# EAGLE design Xbee_Remote_v1.0 (EAGLE 6.2)
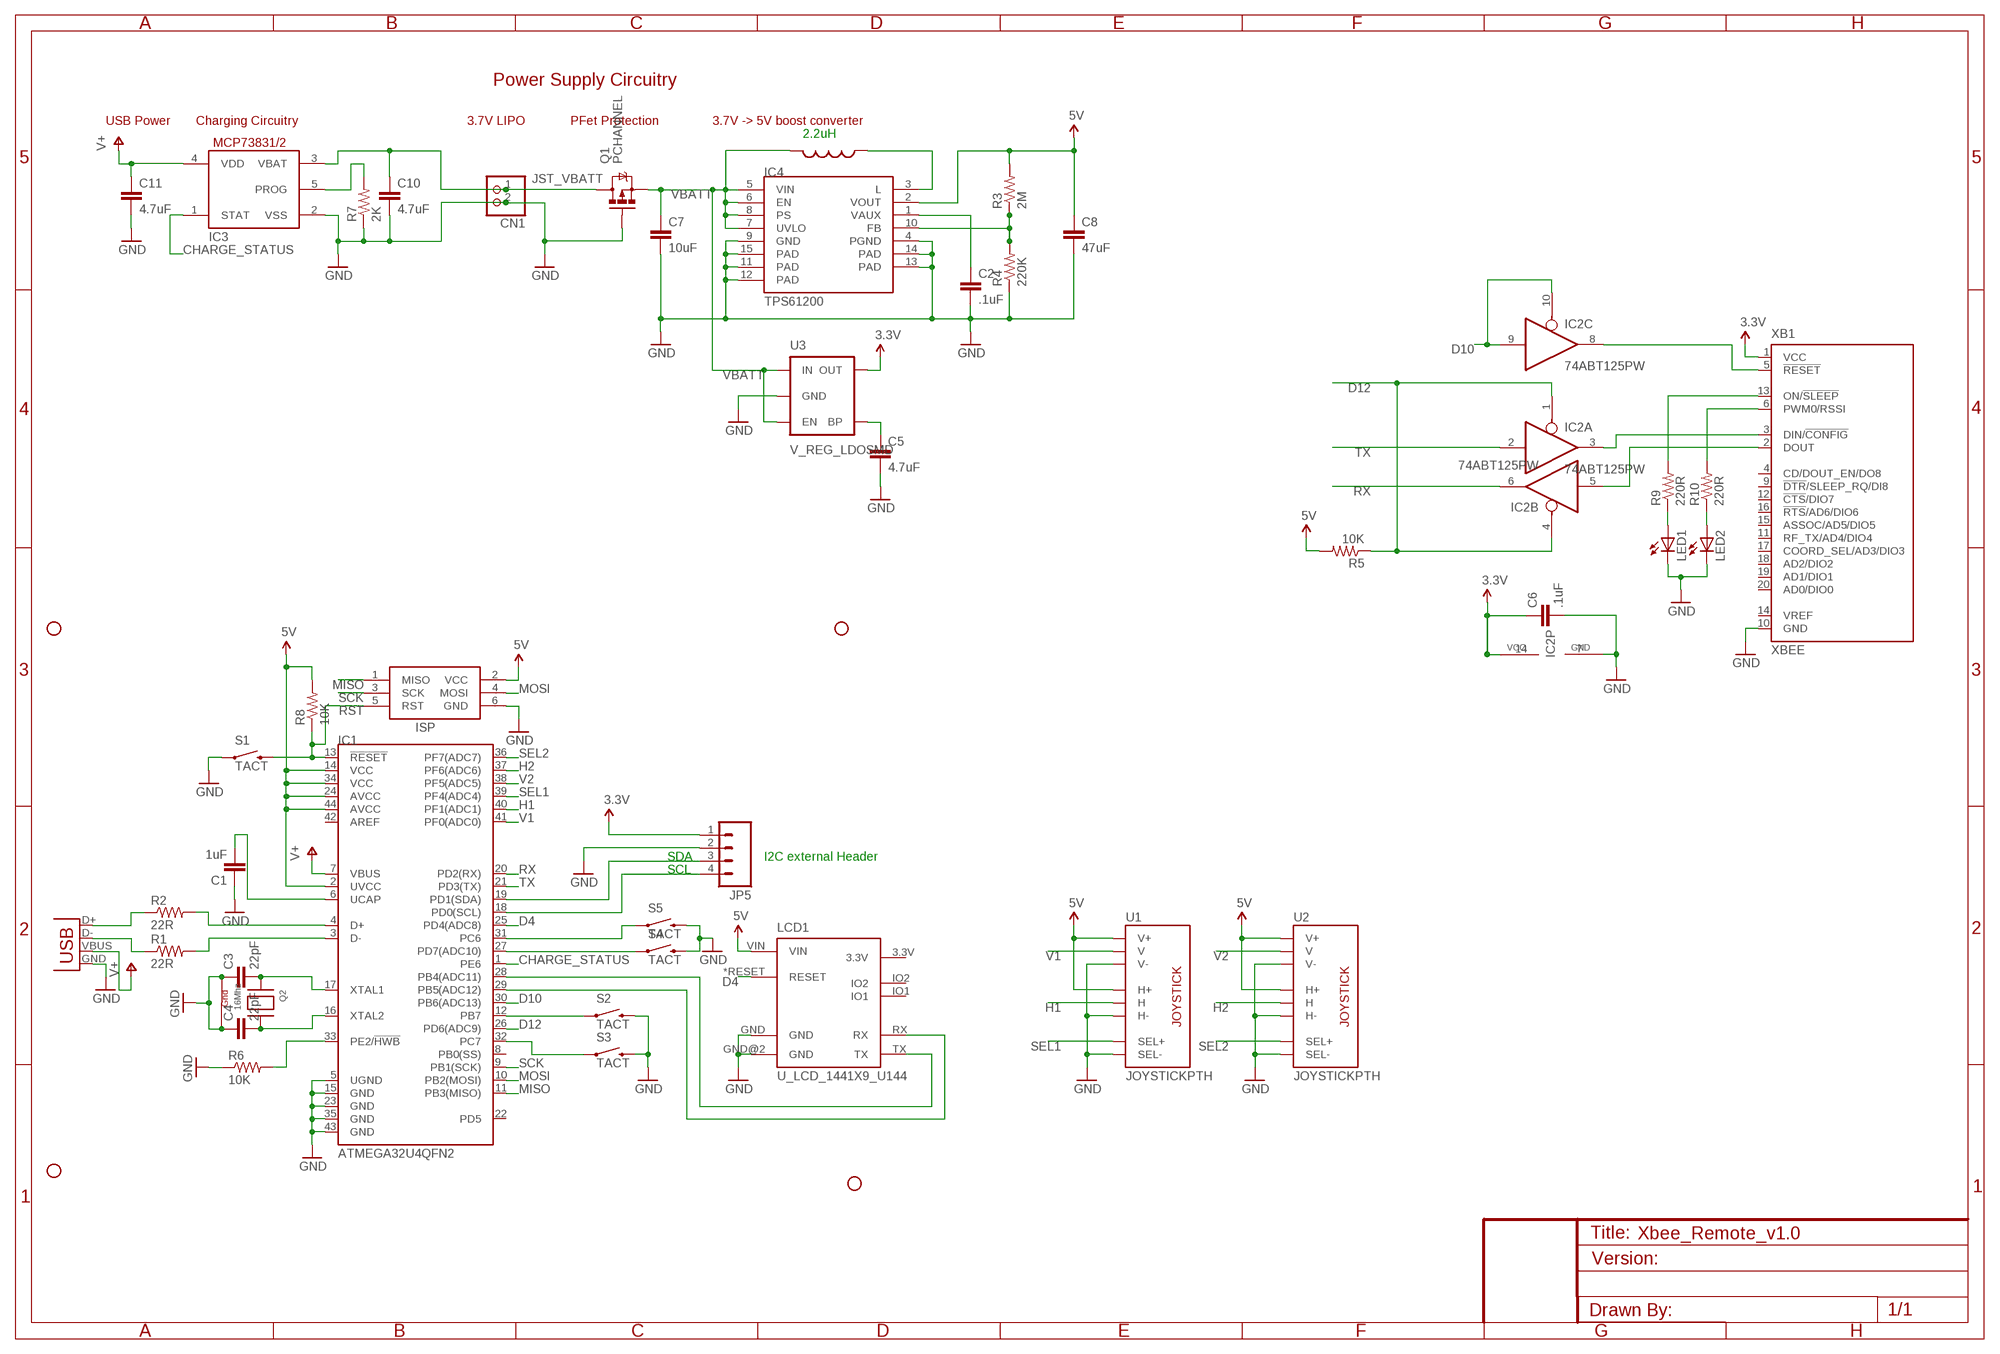
[diagram p0: schematic, sheet 1]

## Parts
C1  1uF  CAP0805  [0805]
C2  .1uF  CAP0805  [0805]
C3  22pF  CAP0805  [0805]
C4  22pF  CAP0805  [0805]
C5  4.7uF  CAP0805  [0805]
C6  .1uF  CAP0805  [0805]
C7  10uF  CAP0805  [0805]
C8  47uF  CAP1206  [1206]
C10  4.7uF  CAP0805  [0805]
C11  4.7uF  CAP0805  [0805]
CN1  JST_2PIN-SMT-RA  [JST-PH-2-SMT-RA]
IC1  ATMEGA32U4QFN2  [QFN-44-NOPAD]
IC2  74ABT125PW  [TSSOP14]
IC3  MCP73831/OT  [SOT23-5L]
IC4  TPS61200  [QFN-10_PAD]
ISP  AVRISP-6  [AVRISP]
JP1  STAND-OFF  [STAND-OFF]
JP2  STAND-OFF  [STAND-OFF]
JP3  STAND-OFF  [STAND-OFF]
JP4  STAND-OFF  [STAND-OFF]
JP5  M04PTH  [1X04]
L1  2.2uH  INDUCTOREPL2014  [COILCRAFT_EPL2014]
LCD1  U_LCD_1441X9_U144  [U_LCD_144]
LED1  LEDCHIPLED_0805  [CHIPLED_0805]
LED2  LEDCHIPLED_0805  [CHIPLED_0805]
Q1  PCHANNEL  MOSFET-PCHANNELSMD  [SOT23-3]
Q2  16Mhz  XTAL-4-3225  [NX3225]
R1  22R  RESISTOR  [0805]
R2  22R  RESISTOR  [0805]
R3  2M  RESISTOR  [0805]
R4  220K  RESISTOR  [0805]
R5  10K  RESISTOR  [0805]
R6  10K  RESISTOR  [0805]
R7  2K  RESISTOR  [0805]
R8  10K  RESISTOR  [0805]
R9  220R  RESISTOR  [0805]
R10  220R  RESISTOR  [0805]
S1  TACT  SWITCH-MOMENTARY-2SMD  [TACTILE_SWITCH_SMD]
S2  TACT  SWITCH-MOMENTARY-2SMD  [TACTILE_SWITCH_SMD]
S3  TACT  SWITCH-MOMENTARY-2SMD  [TACTILE_SWITCH_SMD]
S4  TACT  SWITCH-MOMENTARY-2SMD  [TACTILE_SWITCH_SMD]
S5  TACT  SWITCH-MOMENTARY-2SMD  [TACTILE_SWITCH_SMD]
U1  JOYSTICKPTH  [JOYSTICK]
U2  JOYSTICKPTH  [JOYSTICK]
U3  V_REG_LDOSMD  [SOT23-5]
X1  USB-MICROB  [USB-MICROB]
XB1  XBEE  [XBEE]

## Nets
3.3V: C6.1 IC2.14(P:VCC) JP5.1 U3.5(OUT) XB1.1(VCC)
5V: C8.1 IC1.2(UVCC) IC1.14(VCC) IC1.24(AVCC) IC1.34(VCC) IC1.44(AVCC) IC4.2(VOUT) ISP.2(VCC) LCD1.VIN R3.2 R5.2 R8.2 U1.H1(H+) U1.V1(V+) U2.H1(H+) U2.V1(V+)
CHARGE_STATUS: IC1.1(PE6) IC3.1(STAT)
D2: IC1.19(PD1(SDA)) JP5.3
D3: IC1.18(PD0(SCL)) JP5.4
D4: IC1.25(PD4(ADC8)) LCD1.*RESET(RESET)
D5: IC1.31(PC6) S5.1
D6: IC1.27(PD7(ADC10)) S4.1
D10: IC1.30(PB6(ADC13)) IC2.9(C:I) IC2.10(C:OE)
D11: IC1.12(PB7) S2.1
D12: IC1.26(PD6(ADC9)) IC2.1(A:OE) IC2.4(B:OE) R5.1
D13: IC1.32(PC7) S3.1
GND: C1.1 C2.2 C3.1 C4.1 C5.2 C6.2 C7.2 C8.2 C10.2 C11.2 CN1.2 IC1.5(UGND) IC1.15(GND) IC1.23(GND) IC1.35(GND) IC1.43(GND) IC2.7(P:GND) IC3.2(VSS) IC4.4(PGND) IC4.9(GND) IC4.11(PAD) IC4.12(PAD) IC4.13(PAD) IC4.14(PAD) IC4.15(PAD) ISP.6(GND) JP5.2 LCD1.GND LCD1.GND@2(GND) LED1.C LED2.C Q1.1(G) Q2.2(G1) Q2.4(G2) R4.1 R6.1 R7.1 S1.1 S2.3 S3.3 S4.3 S5.3 U1.B2A(SEL-) U1.H3(H-) U1.V3(V-) U2.B2A(SEL-) U2.H3(H-) U2.V3(V-) U3.2(GND) X1.GND XB1.10(GND)
H1: IC1.40(PF1(ADC1)) U1.H2(H)
H2: IC1.37(PF6(ADC6)) U2.H2(H)
JST_VBATT: C10.1 CN1.1 IC3.3(VBAT) Q1.3(D)
LCD_RX: IC1.29(PB5(ADC12)) LCD1.RX
LCD_TX: IC1.28(PB4(ADC11)) LCD1.TX
MISO: IC1.11(PB3(MISO)) ISP.1(MISO)
MOSI: IC1.10(PB2(MOSI)) ISP.4(MOSI)
N$1: R2.1 X1.D+
N$2: R1.1 X1.D-
N$3: IC1.4(D+) R2.2
N$4: IC1.3(D-) R1.2
N$5: C1.2 IC1.6(UCAP)
N$6: IC3.5(PROG) R7.2
N$7: IC4.3(L) L1.P$1
N$8: C5.1 U3.4(BP)
N$9: IC4.10(FB) R3.1 R4.2
N$10: C2.1 IC4.1(VAUX)
N$11: C3.2 IC1.17(XTAL1) Q2.1(X1)
N$13: C4.2 IC1.16(XTAL2) Q2.3(X2)
N$14: IC2.8(C:O) XB1.5(!RESET)
N$16: IC1.33(PE2/!HWB) R6.2
N$18: LED1.A R9.1
N$19: LED2.A R10.1
ON: R9.2 XB1.13(ON/!SLEEP)
RSSI: R10.2 XB1.6(PWM0/RSSI)
RST: IC1.13(!RESET) ISP.5(RST) R8.1 S1.3
RX: IC1.20(PD2(RX)) IC2.6(B:O)
SCK: IC1.9(PB1(SCK)) ISP.3(SCK)
SEL1: IC1.39(PF4(ADC4)) U1.B1A(SEL+)
SEL2: IC1.36(PF7(ADC7)) U2.B1A(SEL+)
TX: IC1.21(PD3(TX)) IC2.2(A:I)
V1: IC1.41(PF0(ADC0)) U1.V2(V)
V2: IC1.38(PF5(ADC5)) U2.V2(V)
V+: C11.1 IC1.7(VBUS) IC3.4(VDD) X1.VBUS
VBATT: C7.1 IC4.5(VIN) IC4.6(EN) IC4.7(UVLO) IC4.8(PS) L1.P$2 Q1.2(S) U3.1(IN) U3.3(EN)
XBEE_RX: IC2.3(A:O) XB1.3(DIN/!CONFIG)
XBEE_TX: IC2.5(B:I) XB1.2(DOUT)
Unconnected: IC1.8(PB0(SS)) IC1.22(PD5) IC1.42(AREF) IC2.11(D:O) IC2.12(D:I) IC2.13(D:OE) LCD1.3.3V LCD1.IO1 LCD1.IO2 XB1.4(CD/DOUT_EN/DO8) XB1.9(!DTR!/SLEEP_RQ/DI8) XB1.11(RF_TX/AD4/DIO4) XB1.12(!CTS!/DIO7) XB1.14(VREF) XB1.15(ASSOC/AD5/DIO5) XB1.16(!RTS!/AD6/DIO6) XB1.17(COORD_SEL/AD3/DIO3) XB1.18(AD2/DIO2) XB1.19(AD1/DIO1) XB1.20(AD0/DIO0)

## Notes on the sheet
- Power Supply Circuitry
- USB Power | Charging Circuitry | 3.7V LIPO | PFet Protection | 3.7V -> 5V boost converter
- 2.2uH
- SDA | I2C external Header
- SCL

## Library data of the parts
C1-C7 C10 C11 = KippKitts:CAP: Capacitor Standard 0603 ceramic capacitor, and 0.1" leaded capacitor.
C8 = SparkFun:CAP: Capacitor Standard 0603 ceramic capacitor, and 0.1" leaded capacitor.
CN1 = adafruit:JST_2PIN: JST 2-Pin Connectors of various flavors SMT-RA (S2B-PH-SM4) 4UConnector #17311 SMT (B2B-PH-SM4) THM-RA (S2B-PH) THM (B2B-PH)
IC1 = SparkFun:ATMEGA32U4
IC2 = 74xx-us:74*125: Quad bus BUFFER, 3-state
IC3 = adafruit:MCP73831: MCP73831/2 Miniature Single-Cell, Fully Integrated Li-Ion, Li-Polymer Charge Management Controllers. Nice and small simple lipoly charge controller, with adjustable current and status output (LED) http://www.ladyada.net/library/pcb/eaglelibrary.html
IC4 = SparkFun:TPS61200: DC to DC Booster
ISP = adafruit:AVRISP: AVR ISP HEADER Standard 6 pin header for AVR programming
JP1-JP4 = SparkFun:STAND-OFF: Stand Off This is the mechanical footprint for a #4 phillips button head screw. Use the keepout ring to avoid running the screw head into surrounding components. SKU : PRT-00447
JP5 = SparkFun:M04: Header 4 Standard 4-pin 0.1" header. Use with straight break away headers (SKU : PRT-00116), right angle break away headers (PRT-00553), swiss pins (PRT-00743), machine pins (PRT-00117), and female headers (PRT-00115). Molex polarized connector foot print use with SKU : PRT-08231 with associated crimp pins and housings. 1MM SMD Version SKU: PRT-10208
L1 = KippKitts:INDUCTOR
LCD1 = KippKitts:U_LCD_144
LED1 LED2 = Tabber:LED: LED OSRAM: - CHIPLED LG R971, LG N971, LY N971, LG Q971, LY Q971, LO R971, LY R971 LH N974, LH R974 LS Q976, LO Q976, LY Q976 LO Q996 - Hyper CHIPLED LW Q18S LB Q993, LB Q99A, LB R99A - SideLED LS A670, LO A670, LY A670, LG A670, LP A670 LB A673, LV A673, LT A673, LW A673 LH A674 LY A675 LS A676, LA A676, LO A676, LY A676, LW A676 LS A679, LY A679, LG A679 - Hyper Micro SIDELED® LS Y876, LA Y876, LO Y876, LY Y876 LT Y87S - SmartLED LW L88C, LW L88S LB L89C, LB L89S, LG L890 LS L89K, LO L89K, LY L89K LS L896, LA L896, LO L896, LY L896 - TOPLED LS T670, LO T670, LY T670, LG T670, LP T670 LSG T670, LSP T670, LSY T670, LOP T670, LYG T670 LG T671, LOG T671, LSG T671 LB T673, LV T673, LT T673, LW T673 LH T674 LS T676, LA T676, LO T676, LY T676, LB T676, LH T676, LSB T676, LW T676 LB T67C, LV T67C, LT T67C, LS T67K, LO T67K, LY T67K, LW E67C LS E67B, LA E67B, LO E67B, LY E67B, LB E67C, LV E67C, LT E67C LW T67C LS T679, LY T679, LG T679 LS T770, LO T770, LY T770, LG T770, LP T770 LB T773, LV T773, LT T773, LW T773 LH T774 LS E675, LA E675, LY E675, LS T675 LS T776, LA T776, LO T776, LY T776, LB T776 LHGB T686 LT T68C, LB T68C - Hyper Mini TOPLED® LB M676 - Mini TOPLED Santana® LG M470 LS M47K, LO M47K, LY M47K Source: http://www.osram.convergy.de LUXEON: - LUMILED® LXK2-PW12-R00, LXK2-PW12-S00, LXK2-PW14-U00, LXK2-PW14-V00 LXK2-PM12-R00, LXK2-PM12-S00, LXK2-PM14-U00 LXK2-PE12-Q00, LXK2-PE12-R00, LXK2-PE12-S00, LXK2-PE14-T00, LXK2-PE14-U00 LXK2-PB12-K00, LXK2-PB12-L00, LXK2-PB12-M00, LXK2-PB14-N00, LXK2-PB14-P00, LXK2-PB14-Q00 LXK2-PR12-L00, LXK2-PR12-M00, LXK2-PR14-Q00, LXK2-PR14-R00 LXK2-PD12-Q00, LXK2-PD12-R00, LXK2-PD12-S00 LXK2-PH12-R00, LXK2-PH12-S00 LXK2-PL12-P00, LXK2-PL12-Q00, LXK2-PL12-R00 Source: www.luxeon.com KINGBRIGHT: KA-3528ASYC Source: www.kingbright.com
Q1 = SparkFun:MOSFET-PCHANNEL
Q2 = adafruit:XTAL-4: Classic 4-pin 3.2 x 2.5mm crystal
R1-R10 = KippKitts:RESISTOR: Resistor Basic schematic elements and footprints for 0603, 1206, and PTH 1/10th watt (small) resistors.
S1-S5 = SparkFun:SWITCH-MOMENTARY-2
U1 U2 = SparkFun:JOYSTICK: Thumb Joystick Joystick commonly found in PS2 controllers. Two pots and a select switch. Footprint proven. Spark Fun Electronics SKU : COM-09032
U3 = SparkFun:V_REG_LDO: Voltage Regulator LDO Standard 150mA LDO voltage regulator in SOT-23 layout. Micrel part MIC5205. BP (by-pass) pin is used to lower output noise with 470pF cap.
X1 = SparkFun:USB: USB Connectors USB-B-PTH is fully proven SKU : PRT-00139 USB-miniB is fully proven SKU : PRT-00587 USB-A-PCB is untested. USB-A-H is throughly reviewed, but untested. Spark Fun Electronics SKU : PRT-00437 USB-B-SMT is throughly reviewed, but untested. Needs silkscreen touching up. USB-A-S has not been used/tested USB-MB-H has not been used/tested
XB1 = maxstream:XBEE: XBee (TM) /XBee-PRO(TM) OEM RF Modules Source: MaxStream, Inc. xbee_productmanual.pdf; MPN: XBP24-Z7UIT-004; OC_FARNELL: 1751799; OC_NEWARK: 34R5507

## Board
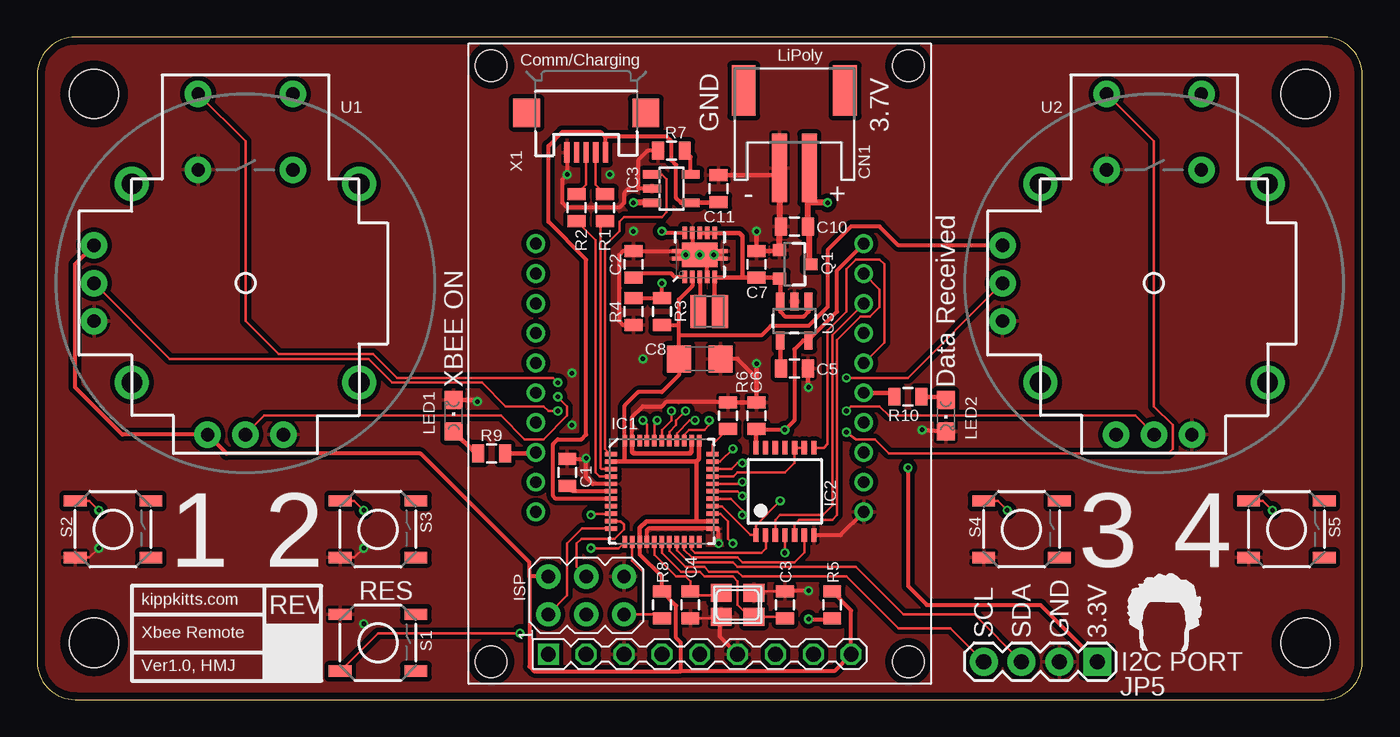
[diagram p1: board, top side]
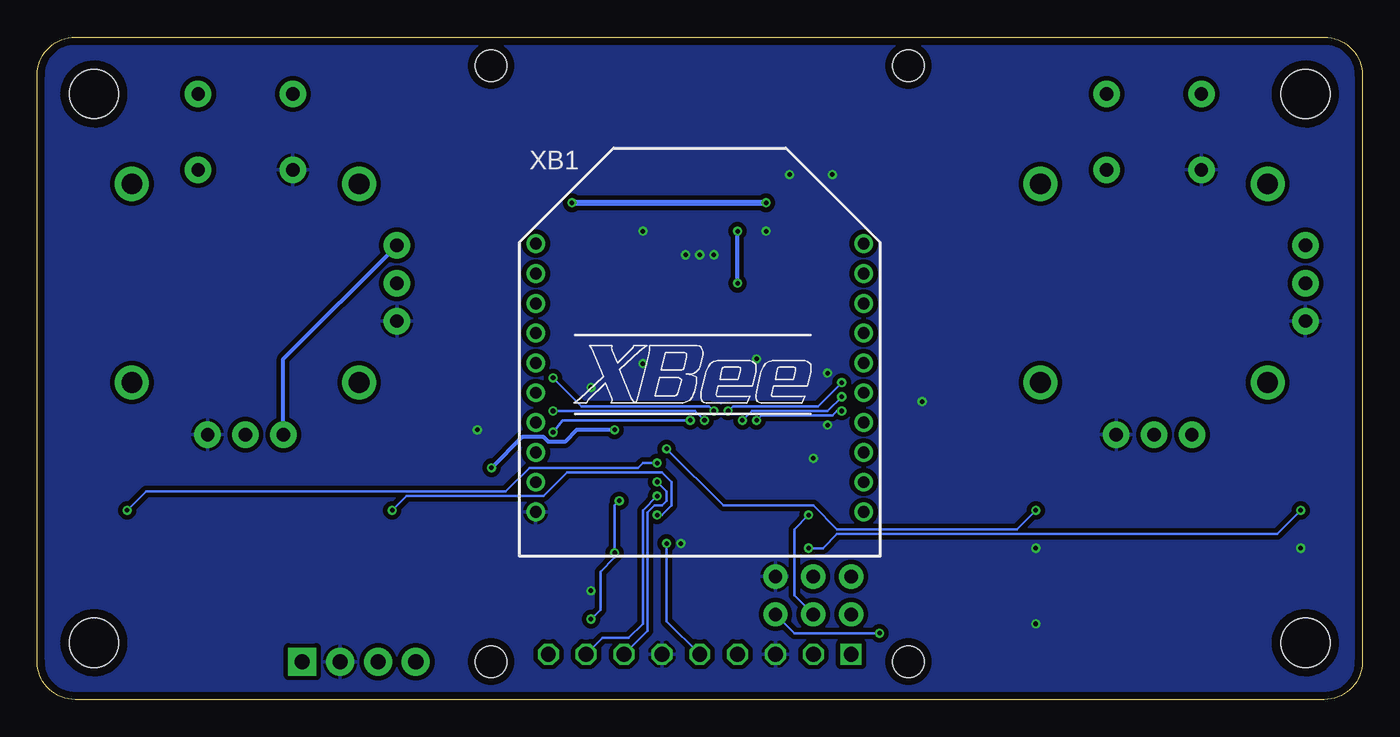
[diagram p2: board, bottom side, seen from below]

Size 88.9 x 44.45 mm. Coordinates in mm from the lower left corner, seen from the top.
Outline: 0,41.91 0,2.54 arc90 2.54,0 86.36,0 arc90 88.9,2.54 88.9,41.91 arc90 86.36,44.45 2.54,44.45 arc90 0,41.91
Copper layers (1*16): Top 0.035mm / dielectric 1.5mm / Bottom 0.035mm
Design rules: minimum track width 6mil, minimum drill 12mil, track to track 6mil, track to pad 6mil, pad to pad 6mil, via to via 6mil, smd to smd 6mil, copper to edge 20mil, drill to drill 8mil, minimum pad ring 8mil, minimum via ring 6mil, stop-mask expansion 3mil, vias tented up to drill 0mil, thermal gap 8mil

### Footprints (pad centres in the part's own frame; a part is rotated, then mirrored left to right if it is on the bottom)
0805 = smd 0.8 x 1.2: 1 -0.9,0; 2 0.9,0
1206 = smd 1.6 x 1.8: 1 -1.4,0; 2 1.4,0
JST-PH-2-SMT-RA = smd 1 x 4.6: 1 1,-3.7; 2 -1,-3.7 | smd 1.6 x 3.4: NC1 -3.4,1.5; NC2 3.4,1.5
QFN-44-NOPAD = smd 0.8 x 0.3: 1 -3.4,2.5; 2 -3.4,2; 3 -3.4,1.5; 4 -3.4,1; 5 -3.4,0.5; 6 -3.4,0; 7 -3.4,-0.5; 8 -3.4,-1; 9 -3.4,-1.5; 10 -3.4,-2; 11 -3.4,-2.5; 23 3.4,-2.5; 24 3.4,-2; 25 3.4,-1.5; 26 3.4,-1; 27 3.4,-0.5; 28 3.4,0; 29 3.4,0.5; 30 3.4,1; 31 3.4,1.5; 32 3.4,2; 33 3.4,2.5 | smd 0.3 x 0.8: 12 -2.5,-3.4; 13 -2,-3.4; 14 -1.5,-3.4; 15 -1,-3.4; 16 -0.5,-3.4; 17 0,-3.4; 18 0.5,-3.4; 19 1,-3.4; 20 1.5,-3.4; 21 2,-3.4; 22 2.5,-3.4; 34 2.5,3.4; 35 2,3.4; 36 1.5,3.4; 37 1,3.4; 38 0.5,3.4; 39 0,3.4; 40 -0.5,3.4; 41 -1,3.4; 42 -1.5,3.4; 43 -2,3.4; 44 -2.5,3.4
TSSOP14 = smd 0.35 x 0.9: 1 -1.95,-2.925; 2 -1.3,-2.925; 3 -0.65,-2.925; 4 0,-2.925; 5 0.65,-2.925; 6 1.3,-2.925; 7 1.95,-2.925; 8 1.95,2.925; 9 1.3,2.925; 10 0.65,2.925; 11 0,2.925; 12 -0.65,2.925; 13 -1.3,2.925; 14 -1.95,2.925
SOT23-5L = smd 0.55 x 1.2: 1 -0.95,-1.3; 2 0,-1.3; 3 0.95,-1.3; 4 0.95,1.3; 5 -0.95,1.3
QFN-10_PAD = smd 0.297 x 0.85: 1 -1,-1.475; 2 -0.5,-1.475; 3 0,-1.475; 4 0.5,-1.475; 5 1,-1.475; 6 1,1.475; 7 0.5,1.475; 8 0,1.475; 9 -0.5,1.475; 10 -1,1.475 | smd 0.7 x 0.28: 11 -1.5,0.25; 12 -1.5,-0.25; 13 1.5,0.25; 14 1.5,-0.25 | smd 2.4 x 1.65: 15 0,0
AVRISP = drill 0.9 pad 1.626: 1 -1.27,2.54; 2 1.27,2.54; 3 -1.27,0; 4 1.27,0; 5 -1.27,-2.54; 6 1.27,-2.54
STAND-OFF = hole 3.302: 0,0
1X04 = drill 1.016 pad 1.88 square: 1 0,0 | drill 1.016 pad 1.88: 2 2.54,0; 3 5.08,0; 4 7.62,0
COILCRAFT_EPL2014 = smd 1.041 x 2.21: P$1 -0.724,0; P$2 0.724,0
U_LCD_144 = drill 1 square: 3.3V -10.16,0.5 | drill 1 octagon: *RESET 0,0.5; GND -5.08,0.5; GND@2 2.54,0.5; IO1 -2.54,0.5; IO2 -7.62,0.5; RX 5.08,0.5; TX 7.62,0.5; VIN 10.16,0.5 | hole 2.1: -14,0; 14,0; 14,40; -14,40
CHIPLED_0805 = smd 1.2 x 1.2: A 0,-1.05; C 0,1.05
SOT23-3 = smd 0.8 x 0.9: 1 -0.95,-1; 2 0.95,-1; 3 0,1.1
NX3225 = smd 1.4 x 1.2: 1 -1.1,0.8; 2 1.1,0.8; 3 1.1,-0.8; 4 -1.1,-0.8
TACTILE_SWITCH_SMD = smd 1.524 x 0.762: 1 -2.54,1.905; 2 2.54,1.905; 3 -2.54,-1.905; 4 2.54,-1.905
JOYSTICK = drill 0.9 pad 1.778: B1A -3.175,12.7; B1B 3.175,12.7; B2A -3.175,7.62; B2B 3.175,7.62 | drill 0.889 pad 1.778: H1 -2.54,-10.16; H2 0,-10.16; H3 2.54,-10.16; V1 -10.16,2.54; V2 -10.16,0; V3 -10.16,-2.54 | drill 1.397 pad 2.286: MOUNT1 -7.62,6.668; MOUNT2 -7.62,-6.668; MOUNT3 7.62,-6.668; MOUNT4 7.62,6.668
SOT23-5 = smd 0.55 x 1.2: 1 -0.95,-1.3; 2 0,-1.3; 3 0.95,-1.3; 4 0.95,1.3; 5 -0.95,1.3
USB-MICROB = smd 0.35 x 1.4: D+ 0,2.65; D- -0.65,2.65; GND 1.3,2.65; ID 0.65,2.65; VBUS -1.3,2.65 | smd 1.8 x 1.9: MT1 -4,0; MT2 4,0
XBEE = drill 0.8 pad 1.27: 1 -11,9; 2 -11,7; 3 -11,5; 4 -11,3; 5 -11,1; 6 -11,-1; 7 -11,-3; 8 -11,-5; 9 -11,-7; 10 -11,-9; 11 11,-9; 12 11,-7; 13 11,-5; 14 11,-3; 15 11,-1; 16 11,1; 17 11,3; 18 11,5; 19 11,7; 20 11,9

### Placement (x,y rotation side)
C1  35.56,15.24 270 top
C2  40.01,29.21 90 top
C3  50.17,6.35 270 top
C4  43.82,6.35 90 top
C5  50.8,22.23 0 top
C6  48.26,19.05 90 top
C7  48.26,29.21 90 top
C8  44.45,22.86 0 top
C10  50.8,31.75 180 top
C11  45.72,34.29 90 top
CN1  50.8,39.37 0 top
IC1  41.91,13.97 0 top
IC2  50.17,13.97 0 top
IC3  42.55,34.29 270 top
IC4  44.45,29.84 0 top
ISP  36.83,6.99 90 top
JP1  3.81,40.64 0 top
JP2  85.09,40.64 0 top
JP3  3.81,3.81 0 top
JP4  85.09,3.81 0 top
JP5  71.12,2.54 180 top
L1  45.09,26.04 0 top
LCD1  44.45,2.54 0 top
LED1  27.94,19.05 0 top
LED2  60.96,19.05 180 top
Q1  50.8,29.21 270 top
Q2  46.99,6.35 180 top
R1  38.1,33.02 270 top
R2  36.2,33.02 270 top
R3  41.91,26.04 270 top
R4  40.01,26.04 90 top
R5  53.34,6.35 90 top
R6  46.36,19.05 270 top
R7  42.55,36.83 0 top
R8  41.91,6.35 90 top
R9  30.48,16.51 0 top
R10  58.42,20.32 180 top
S1  22.86,3.81 0 top
S2  5.08,11.43 0 top
S3  22.86,11.43 0 top
S4  66.04,11.43 0 top
S5  83.82,11.43 0 top
U1  13.97,27.94 0 top
U2  74.93,27.94 0 top
U3  50.8,25.4 180 top
U$9  [TOP_DOCU_5MM]  72.39,2.54 0 top
X1  36.83,39.37 180 top
XB1  44.45,21.59 0 bottom

### Tracks (layer width: path | path; a pad name or v marks a point on that pad's centre or on a via)
3.3V  (via drill 0.3)
  Top 0.254: 51.75,24.13 53.66,26.04 53.66,28.8 XB1.1 | JP5.1 67.31,6.35 59.69,6.35 58.42,7.62 v58.42,15.56 | U3.5 51.41,24.1 50.8,23.5 50.8,18.73 v50.17,18.1 48.31,18.1 C6.1
  Top 0.305: U3.5 51.75,24.13 | IC2.14 48.22,18.11 C6.1
  Bottom 0.254: v50.17,18.1 52.71,18.1 53.5,17.3 54.61,17.3 54.93,17.62 56.36,17.62 v58.42,15.56
5V
  Top 0.254: 43.05,24.45 C8.1 43.05,21.78 41.91,20.64 40.32,20.64 39.41,19.73 IC1.44 | 43.05,24.45 43.05,25.08 | 43.05,25.08 43.05,26.86 43.95,27.76 IC4.2 | R3.2 43,25.14 43.05,25.08 | IC1.14 40.41,9.76 41.91,8.26 R8.2 42.86,6.3 42.86,4.13 43.18,3.81 43.18,1.91 | 43.18,1.91 53.48,1.91 LCD1.VIN 54.61,5.98 R5.2 | ISP.2 33.02,8.26 | 33.02,8.26 33.02,2.22 33.34,1.91 43.18,1.91 | U2.V1 57.79,30.48 56.52,31.75 54.61,31.75 53.02,30.16 53.02,26.35 51.75,25.08 49.21,25.08 48.58,24.45 43.05,24.45 | 33.02,8.26 33.02,9.21 25.72,16.51 12.7,16.51 U1.H1 5.71,17.78 2.54,20.95 2.54,29.21 U1.V1
  Top 0.305: IC1.34 44.41,16.15 44.23,15.97 | IC1.24 44.23,11.97 | 44.23,11.97 40.86,11.97 40.41,11.52 IC1.14 | IC1.2 39.41,15.97 | IC1.44 39.41,15.97 | 39.41,15.97 44.23,15.97 | 44.23,15.97 44.23,11.97
  Bottom 0.254: U2.H1 72.39,22.86 U2.V1
CHARGE_STATUS
  Top 0.152: IC3.1 41.91,35.24 42.23,34.92 42.23,32.7 41.91,32.38 39.37,32.38 39.05,32.07 39.05,31.43 38.1,30.48 38.1,16.83 38.37,16.56 38.42,16.56 IC1.1
D2
  Top 0.152: IC1.19 42.91,10.02 43.72,9.21 46.67,9.21 46.99,8.89 54.93,8.89 58.1,5.71 62.87,5.71 JP5.3
D3
  Top 0.152: IC1.18 42.41,9.98 43.5,8.89 44.77,8.89 45.09,8.57 46.99,8.57 47.31,8.26 54.29,8.26 57.79,4.76 61.28,4.76 JP5.4
D4  (via drill 0.3)
  Top 0.152: IC1.25 45.84,12.47 46.36,11.96 46.36,10.79 v46.67,10.48
  Bottom 0.152: v46.67,10.48 46.67,5.26 LCD1.*RESET
D5  (via drill 0.3)
  Top 0.152: IC1.31 46.59,15.47 46.99,15.88 v47.31,15.88 | S5.1 82.23,13.34 v82.87,12.7
  Bottom 0.152: v47.31,15.88 48.26,15.88 48.58,15.56 55.88,15.56 57.47,13.97 81.6,13.97 v82.87,12.7
D6  (via drill 0.3)
  Top 0.152: IC1.27 46.54,13.47 47.31,12.7 v47.31,12.38 | S4.1 64.45,13.34 v65.09,12.7
  Bottom 0.152: v47.31,12.38 46.99,12.38 46.36,13.02 46.36,14.61 46.99,15.24 53.34,15.24 54.93,13.65 64.14,13.65 v65.09,12.7
D10
  Top 0.152: IC2.9 IC2.10 50.8,16.88 50.8,15.88 50.17,15.24 46.99,15.24 46.72,14.97 IC1.30
D11  (via drill 0.3)
  Top 0.152: v37.15,10.16 39,10.16 IC1.12 | S2.1 3.49,13.34 v4.13,12.7
  Bottom 0.152: v37.15,10.16 36.2,10.16 35.24,11.11 5.71,11.11 v4.13,12.7
D12  (via drill 0.3)
  Top 0.152: 48.15,11.11 IC2.1 | IC2.1 48.22,11.7 v49.85,13.34 | IC2.4 v50.17,9.84 | IC1.26 45.93,12.97 47.85,11.04 IC2.1
  Top 0.254: v51.75,5.4 53.29,5.4 R5.1
  Bottom 0.152: v49.85,13.34 50.17,13.02 v50.17,9.84 50.17,9.53 51.12,8.57 51.12,6.03 v51.75,5.4
D13  (via drill 0.3)
  Top 0.152: IC1.32 45.82,15.97 v46.67,16.83 | S3.1 21.27,13.34 v21.91,12.7
  Bottom 0.152: v21.91,12.7 23.18,11.43 35.24,11.43 36.83,13.02 42.86,13.02 v46.67,16.83
GND  (via drill 0.3)
  Top 0.152: C4.1 45.79,5.45 Q2.2 | C3.1 48.19,7.25 Q2.4 | S2.3 3.49,9.53 v4.13,10.16 | S3.3 21.27,9.53 v21.91,10.16
  Top 0.254: X1.GND 35.53,35.27 v35.56,35.24 35.24,34.92 35.24,33.34 35.56,33.02 39.05,33.02 39.37,33.34 39.37,33.97 39.69,34.29 | IC3.2 40.32,34.29 40.32,36.2 40.96,36.83 R7.1 | IC4.4 44.95,29.34 IC4.15 43.95,30.34 IC4.9 | R4.1 39.32,25.14 39.05,25.4 39.05,29.84 39.32,30.11 C2.2 42.94,30.11 IC4.11 | IC1.15 40.91,11.38 41,11.47 IC1.23 45.68,11.47 45.68,10.52 v45.72,10.48 | v51.75,7.3 50.22,7.3 C3.1 | 45.79,5.45 45.79,4.24 LCD1.GND@2 | IC2.7 53.91,11.04 XB1.10 | v48.26,22.54 48.26,21.59 46.99,22.86 C8.2 | IC1.43 39.91,18.95 40.64,19.68 41.91,19.68 42.23,20 46.3,20 R6.1 | IC1.5 37.28,14.47 36.83,14.92 v36.83,16.19 36.78,16.14 C1.1
  Top 0.305: C5.2 51.7,21.01 v51.75,20.95 | 49.64,32.02 C10.2 | C11.2 49.54,35.19 49.8,34.92 | IC4.12 IC4.11 43.2,29.84 v43.5,29.84 43.95,30.3 43.95,30.34 | IC4.13 IC4.14 45.7,29.84 v45.4,29.84 44.95,29.39 44.95,29.34 | Q1.1 49.75,30.11 C7.2 v48.26,31.43 | IC1.43 39.91,16.61 40.01,16.51 43.82,16.51 43.91,16.61 IC1.35 | R6.1 C6.2 v48.26,22.54 | LED1.C 29.43,20.1 v29.53,20 | LED2.C 60.74,18 v59.37,18.1
  Top 0.406: Q1.1 49.8,31.65 C10.2 49.8,31.85 49.8,34.92 CN1.2
  other vias: 44.45,29.84 21.91,5.08 35.88,18.41 35.88,21.91 40.64,22.86 40.01,31.43 38.42,35.24
  pour Bottom (isolate 0.305): -1.27,45.72 90.17,45.72 90.17,-1.27 -1.27,-1.27
  pour Top (isolate 0.305): -2.54,46.99 91.44,46.99 91.44,-2.54 -2.54,-2.54
H1  (via drill 0.3)
  Top 0.152: IC1.40 41.41,18.55 v41.59,18.73 | v34.93,20.32 35.56,19.68 35.56,19.05 33.97,17.46 32.7,17.46 31.11,19.05 15.24,19.05 U1.H2
  Bottom 0.152: v41.59,18.73 40.96,19.37 35.88,19.37 v34.93,20.32
H2  (via drill 0.3)
  Top 0.152: IC1.37 42.91,17.87 43.78,18.73 v44.13,18.73 | v54.29,19.37 54.61,19.68 56.52,19.68 57.15,19.05 73.66,19.05 U2.H2
  Bottom 0.152: v44.13,18.73 44.77,19.37 v54.29,19.37
JST_VBATT  (via drill 0.3)
  Top 0.406: Q1.3 51.8,29.31 51.8,31.65 C10.1 51.7,33.34 | 51.7,33.34 51.7,35.57 CN1.1 | IC3.3 v40.01,33.34 | v53.02,33.34 51.7,33.34
  Bottom 0.406: v53.02,33.34 v40.01,33.34
LCD_RX  (via drill 0.3)
  Top 0.152: IC1.29 47.17,14.47 v47.31,14.61
  Bottom 0.152: v47.31,14.61 46.67,13.97 46.67,13.34 46.99,13.02 47.49,13.02 47.94,12.57 47.94,4.63 LCD1.RX
LCD_TX  (via drill 0.3)
  Top 0.152: IC1.28 46.99,13.97 v47.31,13.65
  Bottom 0.152: v47.31,13.65 48.26,12.7 48.26,5.08 49.21,4.13 50.98,4.13 LCD1.TX
MISO
  Top 0.152: ISP.1 35.56,6.99 35.56,10.48 36.55,11.47 IC1.11
MOSI
  Top 0.152: IC1.10 39.15,11.97 39.37,11.75 39.37,11.43 38.74,10.79 36.51,10.79 36.2,10.48 36.2,8.89 ISP.4
N$1
  Top 0.152: X1.D+ 36.83,34.55 R2.1
N$2
  Top 0.152: X1.D- 37.47,36.7 37.47,34.55 R1.1
N$3
  Top 0.152: IC1.4 37.74,14.97 37.47,15.24 37.47,30.85 R2.2
N$4
  Top 0.152: IC1.3 37.87,15.47 37.78,15.56 37.78,31.8 R1.2
N$5
  Top 0.254: IC1.6 35.93,13.97 C1.2
N$6
  Top 0.254: IC3.5 43.85,36.43 R7.2
N$7
  Top 0.254: IC4.3 44.45,26.12 L1.P$1
N$8
  Top 0.305: U3.4 49.85,22.27 C5.1
N$9  (via drill 0.3)
  Top 0.254: R4.2 R3.1 v41.91,27.94 | IC4.10 42.02,31.32 v41.91,31.43
  Bottom 0.254: v41.91,27.94 v41.91,31.43
N$10
  Top 0.254: IC4.1 42.75,28.37 42.55,28.57 40.27,28.57 C2.1
N$11
  Top 0.152: C3.2 50.07,5.55 Q2.1 47.79,5.55 46.99,6.35 46.99,7.94 46.67,8.26 44.77,8.26 44.45,8.57 43.18,8.57 41.91,9.84 IC1.17
N$13
  Top 0.152: Q2.3 45.57,7.15 45.4,6.99 44.08,6.99 C4.2 43.82,7.94 43.5,8.26 42.86,8.26 41.41,9.71 IC1.16
N$14
  Top 0.152: IC2.8 52.77,16.89 53.02,17.14 53.02,24.77 54.29,26.04 54.29,28.89 54.93,29.53 56.52,29.53 56.83,29.21 56.83,23.97 XB1.5
N$16
  Top 0.152: IC1.33 45.31,17.11 R6.2
N$18
  Top 0.305: R9.1 29.43,16.51 LED1.A
N$19
  Top 0.305: R10.1 60.74,20.32 LED2.A
ON
  Top 0.305: R9.2 33.37,16.51 XB1.13
RSSI
  Top 0.305: XB1.6 57.25,20.59 R10.2
RST  (via drill 0.3)
  Top 0.152: ISP.5 40.64,5.71 | IC1.13 39.91,9.3 40.64,8.57 40.64,5.71 | 40.64,5.71 41.65,5.71 R8.1 | v32.38,4.45 22.86,4.45 S1.3
  Bottom 0.152: v32.38,4.45 38.1,4.45 ISP.5
RX
  Top 0.152: IC1.20 43.41,10.04 43.93,9.53 46.99,9.53 47.31,9.21 50.8,9.21 51.47,9.87 IC2.6
SCK  (via drill 0.3)
  Top 0.152: IC1.9 37.24,12.47 v37.15,12.38
  Bottom 0.152: ISP.3 38.1,6.99 38.1,11.43 v37.15,12.38
SEL1  (via drill 0.3)
  Top 0.152: IC1.39 41.91,18.1 42.55,18.73 v42.55,19.37 | v34.93,21.27 34.61,21.59 24.13,21.59 22.54,23.18 16.19,23.18 13.97,25.4 13.97,37.47 U1.B1A
  Bottom 0.152: v42.55,19.37 42.23,19.68 36.51,19.68 v34.93,21.27
SEL2  (via drill 0.3)
  Top 0.152: IC1.36 43.41,17.77 43.74,18.1 44.77,18.1 45.09,18.41 v45.09,18.73 | U2.B1A 74.93,37.47 74.93,19.68 76.2,18.41 76.2,16.83 75.88,16.51 57.15,16.51 56.2,17.46 54.93,17.46 v54.29,17.94
  Bottom 0.152: v45.09,18.73 53.66,18.73 v54.29,17.94
TX
  Top 0.152: IC1.21 43.91,10.06 44.13,9.84 48.58,9.84 48.9,10.16 48.9,11.02 IC2.2
V1  (via drill 0.3)
  Top 0.152: IC1.41 40.91,18.46 v40.64,18.73 | v34.93,19.37 34.29,19.37 33.97,19.68 31.43,19.68 29.84,21.27 23.81,21.27 22.22,22.86 8.89,22.86 U1.V2
  Bottom 0.152: v40.64,18.73 40.32,19.05 35.56,19.05 35.24,19.37 v34.93,19.37
V2  (via drill 0.3)
  Top 0.152: IC1.38 42.41,17.96 42.86,18.41 42.86,18.73 v43.5,19.37 | v54.29,21.59 58.42,21.59 U2.V2
  Bottom 0.152: v43.5,19.37 43.82,19.68 52.39,19.68 v54.29,21.59
V+
  Top 0.254: 38.13,37.75 37.78,38.1 35.24,38.1 34.29,37.15 34.29,32.07 36.83,29.53 36.83,17.78 36.51,17.46 34.93,17.46 34.61,17.14 34.61,13.65 34.79,13.47 IC1.7 | X1.VBUS 38.13,37.75 | IC3.4 43.18,33.34 42.86,33.66 42.86,35.88 42.55,36.2 42.55,37.47 42.23,37.78 38.16,37.78 38.13,37.75
  Top 0.305: IC3.4 45.67,33.34 C11.1
VBATT
  Top 0.254: 45.45,26.39 L1.P$2 | U3.3 49.85,26.03 50.17,25.72 51.44,25.72 51.75,26.04 U3.1
  Top 0.305: IC4.8 IC4.7 IC4.6 47.1,31.32 47.31,31.11 47.31,28.31 | U3.3 49.85,28.21 Q1.2 49.75,28.31 C7.1 47.31,28.31 | 47.31,28.31 45.45,28.31 IC4.5 45.45,26.39
  Top 0.406: 49.8,26.75 U3.3
XBEE_RX
  Top 0.152: IC2.3 49.52,12.05 49.85,12.38 52.71,12.38 53.34,13.02 53.34,24.48 XB1.3
XBEE_TX
  Top 0.152: IC2.5 50.82,11.76 51.12,12.06 53.34,12.06 53.66,12.38 53.66,24.13 55.25,25.72 55.88,25.72 56.52,26.35 56.52,27.52 XB1.2

### Text on the board
tPlace: Comm/Charging | LiPoly | Xbee Remote | GND | 3.7V | XBEE ON | Data Received | 1 | 2 | 3 | 4 | RES | kippkitts.com | REV | Xbee Remote | SCL | SDA | GND | 3.3V | Ver1.0, HMJ | I2C PORT
Document: 3.45" x 1.75"